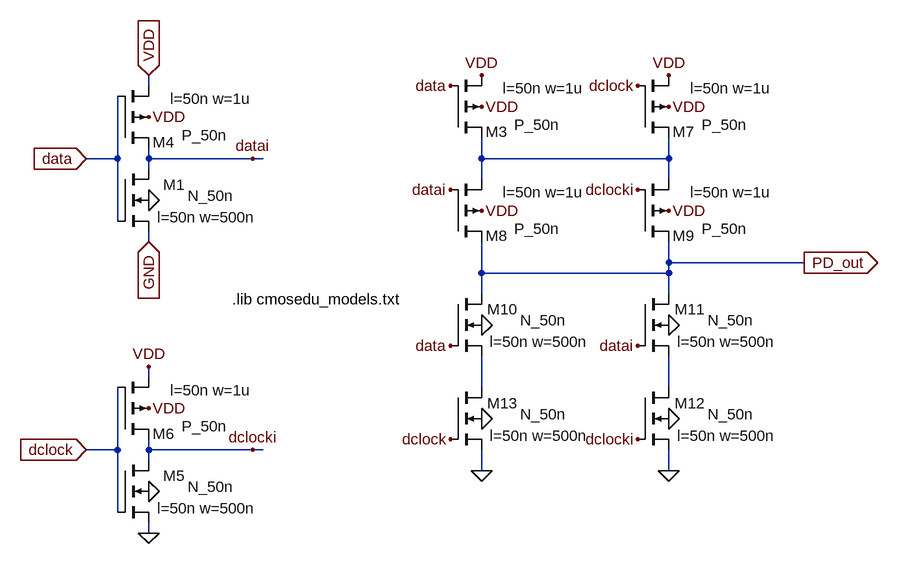
[diagram p0: schematic XOR_PD.asc]
XOR_PD.asc, the LTspice schematic file:
Version 4
SHEET 1 6288 680
WIRE 608 -384 560 -384
WIRE 608 -384 608 -480
WIRE 608 -288 608 -384
WIRE 608 64 560 64
WIRE 608 64 608 -32
WIRE 608 160 608 64
WIRE 656 -496 656 -512
WIRE 656 -384 656 -400
WIRE 656 -368 656 -384
WIRE 656 -256 656 -272
WIRE 656 -48 656 -64
WIRE 656 64 656 48
WIRE 656 80 656 64
WIRE 656 192 656 176
WIRE 816 -384 656 -384
WIRE 816 64 656 64
WIRE 832 -384 816 -384
WIRE 832 64 816 64
WIRE 1168 -384 1168 -416
WIRE 1168 -352 1168 -384
WIRE 1168 -208 1168 -256
WIRE 1168 -176 1168 -208
WIRE 1168 -32 1168 -80
WIRE 1168 96 1168 64
WIRE 1456 -384 1168 -384
WIRE 1456 -384 1456 -416
WIRE 1456 -352 1456 -384
WIRE 1456 -224 1456 -256
WIRE 1456 -208 1168 -208
WIRE 1456 -208 1456 -224
WIRE 1456 -176 1456 -208
WIRE 1456 -32 1456 -80
WIRE 1456 96 1456 64
WIRE 1664 -224 1456 -224
FLAG 656 -320 0
FLAG 656 -448 VDD
FLAG 1168 -464 VDD
FLAG 1456 96 0
FLAG 656 -512 VDD
IOPIN 656 -512 In
FLAG 656 -256 GND
IOPIN 656 -256 In
FLAG 560 -384 data
IOPIN 560 -384 In
FLAG 816 -384 datai
FLAG 656 128 0
FLAG 656 0 VDD
FLAG 560 64 dclock
IOPIN 560 64 In
FLAG 816 64 dclocki
FLAG 656 -64 VDD
FLAG 656 192 0
FLAG 1456 -464 VDD
FLAG 1168 -304 VDD
FLAG 1456 -304 VDD
FLAG 1168 -128 0
FLAG 1456 -128 0
FLAG 1456 16 0
FLAG 1168 16 0
FLAG 1168 96 0
FLAG 1168 -512 VDD
FLAG 1456 -512 VDD
FLAG 1664 -224 PD_out
IOPIN 1664 -224 Out
FLAG 1120 -496 data
FLAG 1120 -96 data
FLAG 1408 -496 dclock
FLAG 1120 48 dclock
FLAG 1120 -336 datai
FLAG 1408 -336 dclocki
FLAG 1408 48 dclocki
FLAG 1408 -96 datai
SYMBOL nmos4 608 -368 R0
WINDOW 0 104 24 Right 0
WINDOW 3 179 41 Right 0
WINDOW 123 213 74 Right 0
SYMATTR InstName M1
SYMATTR Value N_50n
SYMATTR Value2 l=50n w=500n
SYMBOL pmos4 608 -400 M180
WINDOW 0 88 9 Right 0
WINDOW 3 168 20 Right 0
WINDOW 123 206 76 Right 0
SYMATTR InstName M4
SYMATTR Value P_50n
SYMATTR Value2 l=50n w=1u
SYMBOL pmos4 1120 -416 M180
WINDOW 0 88 9 Right 0
WINDOW 3 168 20 Right 0
WINDOW 123 206 76 Right 0
SYMATTR InstName M3
SYMATTR Value P_50n
SYMATTR Value2 l=50n w=1u
SYMBOL nmos4 608 80 R0
WINDOW 0 104 24 Right 0
WINDOW 3 179 41 Right 0
WINDOW 123 213 74 Right 0
SYMATTR InstName M5
SYMATTR Value N_50n
SYMATTR Value2 l=50n w=500n
SYMBOL pmos4 608 48 M180
WINDOW 0 88 9 Right 0
WINDOW 3 168 20 Right 0
WINDOW 123 206 76 Right 0
SYMATTR InstName M6
SYMATTR Value P_50n
SYMATTR Value2 l=50n w=1u
SYMBOL pmos4 1408 -416 M180
WINDOW 0 88 9 Right 0
WINDOW 3 168 20 Right 0
WINDOW 123 206 76 Right 0
SYMATTR InstName M7
SYMATTR Value P_50n
SYMATTR Value2 l=50n w=1u
SYMBOL pmos4 1120 -256 M180
WINDOW 0 88 9 Right 0
WINDOW 3 168 20 Right 0
WINDOW 123 206 76 Right 0
SYMATTR InstName M8
SYMATTR Value P_50n
SYMATTR Value2 l=50n w=1u
SYMBOL pmos4 1408 -256 M180
WINDOW 0 88 9 Right 0
WINDOW 3 168 20 Right 0
WINDOW 123 206 76 Right 0
SYMATTR InstName M9
SYMATTR Value P_50n
SYMATTR Value2 l=50n w=1u
SYMBOL nmos4 1120 -176 R0
WINDOW 0 104 24 Right 0
WINDOW 3 179 41 Right 0
WINDOW 123 213 74 Right 0
SYMATTR InstName M10
SYMATTR Value N_50n
SYMATTR Value2 l=50n w=500n
SYMBOL nmos4 1408 -176 R0
WINDOW 0 104 24 Right 0
WINDOW 3 179 41 Right 0
WINDOW 123 213 74 Right 0
SYMATTR InstName M11
SYMATTR Value N_50n
SYMATTR Value2 l=50n w=500n
SYMBOL nmos4 1408 -32 R0
WINDOW 0 104 24 Right 0
WINDOW 3 179 41 Right 0
WINDOW 123 213 74 Right 0
SYMATTR InstName M12
SYMATTR Value N_50n
SYMATTR Value2 l=50n w=500n
SYMBOL nmos4 1120 -32 R0
WINDOW 0 104 24 Right 0
WINDOW 3 179 41 Right 0
WINDOW 123 213 74 Right 0
SYMATTR InstName M13
SYMATTR Value N_50n
SYMATTR Value2 l=50n w=500n
TEXT 784 -168 Left 0 !.lib cmosedu_models.txt

The netlist it stands for:
* XOR_PD.asc
M1 datai data GND 0 N_50n l=50n w=500n
M4 datai data VDD VDD P_50n l=50n w=1u
M3 N001 data VDD VDD P_50n l=50n w=1u
M5 dclocki dclock 0 0 N_50n l=50n w=500n
M6 dclocki dclock VDD VDD P_50n l=50n w=1u
M7 N001 dclock VDD VDD P_50n l=50n w=1u
M8 PD_out datai N001 VDD P_50n l=50n w=1u
M9 PD_out dclocki N001 VDD P_50n l=50n w=1u
M10 PD_out data N002 0 N_50n l=50n w=500n
M11 PD_out datai N003 0 N_50n l=50n w=500n
M12 N003 dclocki 0 0 N_50n l=50n w=500n
M13 N002 dclock 0 0 N_50n l=50n w=500n
.model NMOS NMOS
.model PMOS PMOS
.lib standard.mos
.lib cmosedu_models.txt
.backanno
.end